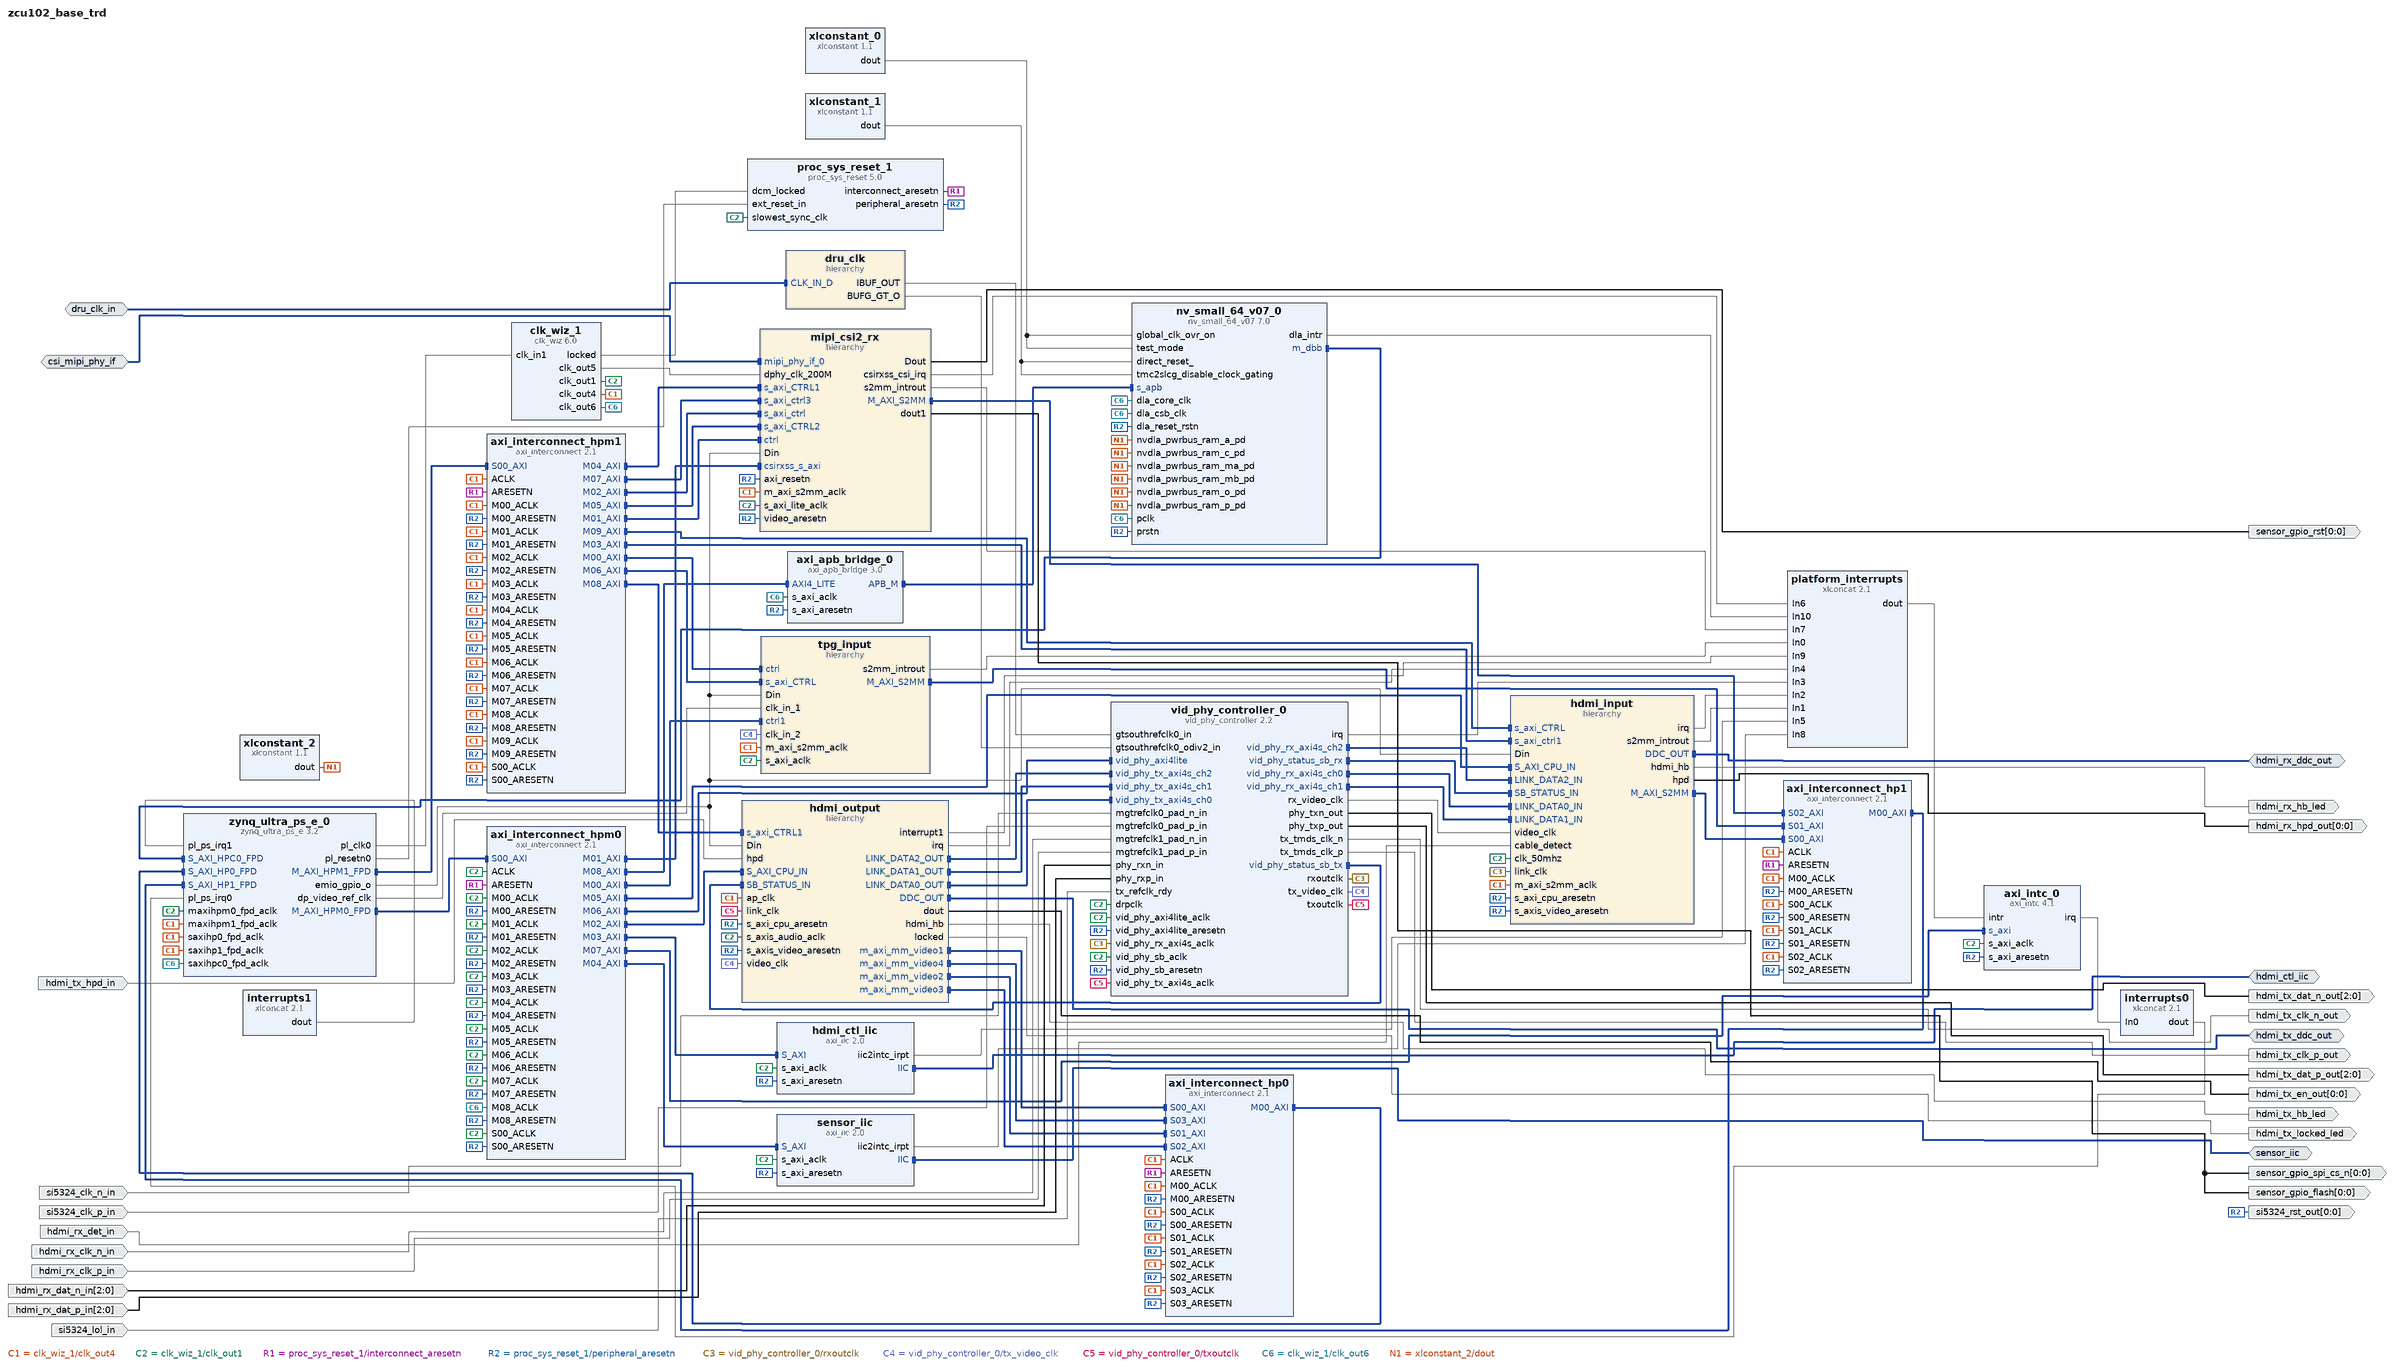
[diagram p0: block diagram of the top level]
# Vivado block design zcu102_base_trd, xczu9eg-ffvb1156-2-e, Vivado 2018.3
create_bd_design zcu102_base_trd

create_bd_intf_port -mode Slave -vlnv xilinx.com:interface:mipi_phy_rtl:1.0 csi_mipi_phy_if
create_bd_intf_port -mode Slave -vlnv xilinx.com:interface:diff_clock_rtl:1.0 dru_clk_in
create_bd_intf_port -mode Master -vlnv xilinx.com:interface:iic_rtl:1.0 hdmi_ctl_iic
create_bd_intf_port -mode Master -vlnv xilinx.com:interface:iic_rtl:1.0 hdmi_rx_ddc_out
create_bd_intf_port -mode Master -vlnv xilinx.com:interface:iic_rtl:1.0 hdmi_tx_ddc_out
create_bd_intf_port -mode Master -vlnv xilinx.com:interface:iic_rtl:1.0 sensor_iic
create_bd_port -dir I hdmi_rx_det_in
create_bd_port -dir O hdmi_rx_hb_led
create_bd_port -dir O -from 0 -to 0 hdmi_rx_hpd_out
create_bd_port -dir O -from 0 -to 0 hdmi_tx_en_out
create_bd_port -dir O hdmi_tx_hb_led
create_bd_port -dir O hdmi_tx_locked_led
create_bd_port -dir I hdmi_tx_hpd_in
create_bd_port -dir I si5324_clk_n_in
create_bd_port -dir I si5324_clk_p_in
create_bd_port -dir I hdmi_rx_clk_n_in
create_bd_port -dir I hdmi_rx_clk_p_in
create_bd_port -dir O -from 0 -to 0 sensor_gpio_rst
create_bd_port -dir I -from 2 -to 0 hdmi_rx_dat_n_in
create_bd_port -dir I -from 2 -to 0 hdmi_rx_dat_p_in
create_bd_port -dir O -from 0 -to 0 -type rst si5324_rst_out
create_bd_port -dir I si5324_lol_in
create_bd_port -dir O -from 0 -to 0 sensor_gpio_spi_cs_n
create_bd_port -dir O -from 0 -to 0 sensor_gpio_flash
create_bd_port -dir O -from 2 -to 0 hdmi_tx_dat_n_out
create_bd_port -dir O -from 2 -to 0 hdmi_tx_dat_p_out
create_bd_port -dir O hdmi_tx_clk_n_out
create_bd_port -dir O hdmi_tx_clk_p_out

create_bd_cell -type hier dru_clk
create_bd_cell -type hier hdmi_input
create_bd_cell -type hier hdmi_output
create_bd_cell -type ip -vlnv xilinx.com:ip:xlconcat:2.1 interrupts0
set_property -dict {CONFIG.NUM_PORTS 1} [get_bd_cells interrupts0]
create_bd_cell -type ip -vlnv xilinx.com:ip:xlconcat:2.1 interrupts1
set_property -dict {CONFIG.NUM_PORTS 1} [get_bd_cells interrupts1]
create_bd_cell -type hier mipi_csi2_rx
create_bd_cell -type ip -vlnv xilinx.com:ip:xlconcat:2.1 platform_interrupts
set_property -dict {CONFIG.NUM_PORTS 11} [get_bd_cells platform_interrupts]
create_bd_cell -type hier tpg_input
create_bd_cell -type ip -vlnv xilinx.com:ip:axi_apb_bridge:3.0 axi_apb_bridge_0
set_property -dict [list \
  CONFIG.C_APB_NUM_SLAVES 1 \
  CONFIG.C_S_AXI_RNG10_BASEADDR 0x0000000090000000 \
  CONFIG.C_S_AXI_RNG10_HIGHADDR 0x000000009FFFFFFF \
  CONFIG.C_S_AXI_RNG11_BASEADDR 0x00000000A0000000 \
  CONFIG.C_S_AXI_RNG11_HIGHADDR 0x00000000AFFFFFFF \
  CONFIG.C_S_AXI_RNG12_BASEADDR 0x00000000B0000000 \
  CONFIG.C_S_AXI_RNG12_HIGHADDR 0x00000000BFFFFFFF \
  CONFIG.C_S_AXI_RNG13_BASEADDR 0x00000000C0000000 \
  CONFIG.C_S_AXI_RNG13_HIGHADDR 0x00000000CFFFFFFF \
  CONFIG.C_S_AXI_RNG14_BASEADDR 0x00000000D0000000 \
  CONFIG.C_S_AXI_RNG14_HIGHADDR 0x00000000DFFFFFFF \
  CONFIG.C_S_AXI_RNG15_BASEADDR 0x00000000E0000000 \
  CONFIG.C_S_AXI_RNG15_HIGHADDR 0x00000000EFFFFFFF \
  CONFIG.C_S_AXI_RNG16_BASEADDR 0x00000000F0000000 \
  CONFIG.C_S_AXI_RNG16_HIGHADDR 0x00000000FFFFFFFF \
  CONFIG.C_S_AXI_RNG2_BASEADDR 0x0000000010000000 \
  CONFIG.C_S_AXI_RNG2_HIGHADDR 0x000000001FFFFFFF \
  CONFIG.C_S_AXI_RNG3_BASEADDR 0x0000000020000000 \
  CONFIG.C_S_AXI_RNG3_HIGHADDR 0x000000002FFFFFFF \
  CONFIG.C_S_AXI_RNG4_BASEADDR 0x0000000030000000 \
  CONFIG.C_S_AXI_RNG4_HIGHADDR 0x000000003FFFFFFF \
  CONFIG.C_S_AXI_RNG5_BASEADDR 0x0000000040000000 \
  CONFIG.C_S_AXI_RNG5_HIGHADDR 0x000000004FFFFFFF \
  CONFIG.C_S_AXI_RNG6_BASEADDR 0x0000000050000000 \
  CONFIG.C_S_AXI_RNG6_HIGHADDR 0x000000005FFFFFFF \
  CONFIG.C_S_AXI_RNG7_BASEADDR 0x0000000060000000 \
  CONFIG.C_S_AXI_RNG7_HIGHADDR 0x000000006FFFFFFF \
  CONFIG.C_S_AXI_RNG8_BASEADDR 0x0000000070000000 \
  CONFIG.C_S_AXI_RNG8_HIGHADDR 0x000000007FFFFFFF \
  CONFIG.C_S_AXI_RNG9_BASEADDR 0x0000000080000000 \
  CONFIG.C_S_AXI_RNG9_HIGHADDR 0x000000008FFFFFFF \
] [get_bd_cells axi_apb_bridge_0]
create_bd_cell -type ip -vlnv xilinx.com:ip:axi_intc:4.1 axi_intc_0
set_property -dict {CONFIG.C_IRQ_CONNECTION 1} [get_bd_cells axi_intc_0]
create_bd_cell -type ip -vlnv xilinx.com:ip:axi_interconnect:2.1 axi_interconnect_hp0
set_property -dict [list \
  CONFIG.ENABLE_ADVANCED_OPTIONS 0 \
  CONFIG.M00_HAS_DATA_FIFO 2 \
  CONFIG.M00_HAS_REGSLICE 1 \
  CONFIG.NUM_MI 1 \
  CONFIG.NUM_SI 4 \
  CONFIG.S00_HAS_DATA_FIFO 2 \
  CONFIG.S00_HAS_REGSLICE 1 \
  CONFIG.S01_HAS_DATA_FIFO 2 \
  CONFIG.S01_HAS_REGSLICE 1 \
  CONFIG.S02_HAS_DATA_FIFO 2 \
  CONFIG.S02_HAS_REGSLICE 1 \
  CONFIG.S03_HAS_DATA_FIFO 2 \
  CONFIG.S03_HAS_REGSLICE 1 \
  CONFIG.S04_HAS_DATA_FIFO 2 \
  CONFIG.S04_HAS_REGSLICE 1 \
  CONFIG.S05_HAS_DATA_FIFO 2 \
  CONFIG.S05_HAS_REGSLICE 1 \
  CONFIG.S06_HAS_DATA_FIFO 2 \
  CONFIG.S06_HAS_REGSLICE 1 \
  CONFIG.STRATEGY 2 \
  CONFIG.SYNCHRONIZATION_STAGES 2 \
] [get_bd_cells axi_interconnect_hp0]
create_bd_cell -type ip -vlnv xilinx.com:ip:axi_interconnect:2.1 axi_interconnect_hp1
set_property -dict [list \
  CONFIG.ENABLE_ADVANCED_OPTIONS 0 \
  CONFIG.M00_HAS_DATA_FIFO 2 \
  CONFIG.M00_HAS_REGSLICE 1 \
  CONFIG.NUM_MI 1 \
  CONFIG.NUM_SI 3 \
  CONFIG.S00_HAS_DATA_FIFO 2 \
  CONFIG.S00_HAS_REGSLICE 1 \
  CONFIG.S01_HAS_DATA_FIFO 2 \
  CONFIG.S01_HAS_REGSLICE 1 \
  CONFIG.S02_HAS_DATA_FIFO 2 \
  CONFIG.S02_HAS_REGSLICE 1 \
  CONFIG.S03_HAS_DATA_FIFO 2 \
  CONFIG.S03_HAS_REGSLICE 1 \
  CONFIG.S04_HAS_DATA_FIFO 2 \
  CONFIG.S04_HAS_REGSLICE 1 \
  CONFIG.S05_HAS_DATA_FIFO 2 \
  CONFIG.S05_HAS_REGSLICE 1 \
  CONFIG.S06_HAS_DATA_FIFO 2 \
  CONFIG.S06_HAS_REGSLICE 1 \
  CONFIG.STRATEGY 2 \
  CONFIG.SYNCHRONIZATION_STAGES 2 \
] [get_bd_cells axi_interconnect_hp1]
create_bd_cell -type ip -vlnv xilinx.com:ip:axi_interconnect:2.1 axi_interconnect_hpm0
set_property -dict {CONFIG.NUM_MI 9 CONFIG.STRATEGY 1 CONFIG.SYNCHRONIZATION_STAGES 2} [get_bd_cells axi_interconnect_hpm0]
create_bd_cell -type ip -vlnv xilinx.com:ip:axi_interconnect:2.1 axi_interconnect_hpm1
set_property -dict [list \
  CONFIG.ENABLE_ADVANCED_OPTIONS 0 \
  CONFIG.M00_HAS_REGSLICE 1 \
  CONFIG.M01_HAS_REGSLICE 1 \
  CONFIG.M02_HAS_REGSLICE 1 \
  CONFIG.M03_HAS_REGSLICE 1 \
  CONFIG.M04_HAS_REGSLICE 1 \
  CONFIG.M05_HAS_REGSLICE 1 \
  CONFIG.M06_HAS_REGSLICE 1 \
  CONFIG.M07_HAS_REGSLICE 1 \
  CONFIG.M08_HAS_REGSLICE 1 \
  CONFIG.M09_HAS_REGSLICE 1 \
  CONFIG.M10_HAS_REGSLICE 1 \
  CONFIG.NUM_MI 10 \
  CONFIG.S00_HAS_REGSLICE 1 \
  CONFIG.STRATEGY 1 \
  CONFIG.SYNCHRONIZATION_STAGES 2 \
] [get_bd_cells axi_interconnect_hpm1]
create_bd_cell -type ip -vlnv xilinx.com:ip:clk_wiz:6.0 clk_wiz_1
set_property -dict [list \
  CONFIG.CLKIN1_JITTER_PS 200.02 \
  CONFIG.CLKOUT1_DRIVES Buffer \
  CONFIG.CLKOUT1_JITTER 163.726 \
  CONFIG.CLKOUT1_PHASE_ERROR 154.695 \
  CONFIG.CLKOUT1_REQUESTED_OUT_FREQ 50.000 \
  CONFIG.CLKOUT2_DRIVES Buffer \
  CONFIG.CLKOUT2_JITTER 148.390 \
  CONFIG.CLKOUT2_PHASE_ERROR 154.695 \
  CONFIG.CLKOUT2_REQUESTED_OUT_FREQ 75.000 \
  CONFIG.CLKOUT2_USED true \
  CONFIG.CLKOUT3_DRIVES Buffer \
  CONFIG.CLKOUT3_JITTER 129.940 \
  CONFIG.CLKOUT3_PHASE_ERROR 154.695 \
  CONFIG.CLKOUT3_REQUESTED_OUT_FREQ 150.000 \
  CONFIG.CLKOUT3_USED true \
  CONFIG.CLKOUT4_DRIVES Buffer \
  CONFIG.CLKOUT4_JITTER 116.512 \
  CONFIG.CLKOUT4_PHASE_ERROR 154.695 \
  CONFIG.CLKOUT4_REQUESTED_OUT_FREQ 300.000 \
  CONFIG.CLKOUT4_USED true \
  CONFIG.CLKOUT5_DRIVES Buffer \
  CONFIG.CLKOUT5_JITTER 124.151 \
  CONFIG.CLKOUT5_PHASE_ERROR 154.695 \
  CONFIG.CLKOUT5_REQUESTED_OUT_FREQ 200.000 \
  CONFIG.CLKOUT5_USED true \
  CONFIG.CLKOUT6_DRIVES Buffer \
  CONFIG.CLKOUT6_JITTER 129.940 \
  CONFIG.CLKOUT6_PHASE_ERROR 154.695 \
  CONFIG.CLKOUT6_REQUESTED_OUT_FREQ 150.000 \
  CONFIG.CLKOUT6_USED true \
  CONFIG.CLKOUT7_DRIVES Buffer \
  CONFIG.MMCM_CLKFBOUT_MULT_F 24.000 \
  CONFIG.MMCM_CLKIN1_PERIOD 20.002 \
  CONFIG.MMCM_CLKIN2_PERIOD 10.0 \
  CONFIG.MMCM_CLKOUT0_DIVIDE_F 24.000 \
  CONFIG.MMCM_CLKOUT1_DIVIDE 16 \
  CONFIG.MMCM_CLKOUT2_DIVIDE 8 \
  CONFIG.MMCM_CLKOUT3_DIVIDE 4 \
  CONFIG.MMCM_CLKOUT4_DIVIDE 6 \
  CONFIG.MMCM_CLKOUT5_DIVIDE 8 \
  CONFIG.MMCM_DIVCLK_DIVIDE 1 \
  CONFIG.NUM_OUT_CLKS 6 \
  CONFIG.PHASESHIFT_MODE LATENCY \
  CONFIG.PRIM_SOURCE No_buffer \
  CONFIG.USE_INCLK_SWITCHOVER false \
  CONFIG.USE_PHASE_ALIGNMENT true \
  CONFIG.USE_RESET false \
] [get_bd_cells clk_wiz_1]
create_bd_cell -type ip -vlnv xilinx.com:ip:axi_iic:2.0 hdmi_ctl_iic
create_bd_cell -type ip -vlnv xilinx.com:ip:proc_sys_reset:5.0 proc_sys_reset_1
set_property -dict {CONFIG.C_AUX_RESET_HIGH 0} [get_bd_cells proc_sys_reset_1]
create_bd_cell -type ip -vlnv xilinx.com:ip:axi_iic:2.0 sensor_iic
set_property -dict {CONFIG.IIC_FREQ_KHZ 400} [get_bd_cells sensor_iic]
create_bd_cell -type ip -vlnv xilinx.com:ip:vid_phy_controller:2.2 vid_phy_controller_0
set_property -dict [list \
  CONFIG.CHANNEL_ENABLE {X0Y4 X0Y5 X0Y6} \
  CONFIG.CHANNEL_SITE X0Y4 \
  CONFIG.C_FOR_UPGRADE_ARCHITECTURE placeholder \
  CONFIG.C_FOR_UPGRADE_DEVICE placeholder \
  CONFIG.C_FOR_UPGRADE_MAXOPTVOL 0.00 \
  CONFIG.C_FOR_UPGRADE_PACKAGE placeholder \
  CONFIG.C_FOR_UPGRADE_PART placeholder \
  CONFIG.C_FOR_UPGRADE_REFVOL 0.00 \
  CONFIG.C_FOR_UPGRADE_SPEEDGRADE 0 \
  CONFIG.C_INPUT_PIXELS_PER_CLOCK 2 \
  CONFIG.C_INT_HDMI_VER_CMPTBLE 3 \
  CONFIG.C_NIDRU true \
  CONFIG.C_NIDRU_REFCLK_SEL 4 \
  CONFIG.C_RX_REFCLK_SEL 1 \
  CONFIG.C_Rx_Protocol HDMI \
  CONFIG.C_TX_PLL_SELECTION 6 \
  CONFIG.C_TX_REFCLK_SEL 0 \
  CONFIG.C_Tx_Protocol HDMI \
  CONFIG.C_Txrefclk_Rdy_Invert true \
  CONFIG.C_Use_Oddr_for_Tmds_Clkout true \
  CONFIG.C_vid_phy_rx_axi4s_ch_INT_TDATA_WIDTH 20 \
  CONFIG.C_vid_phy_rx_axi4s_ch_TDATA_WIDTH 20 \
  CONFIG.C_vid_phy_rx_axi4s_ch_TUSER_WIDTH 1 \
  CONFIG.C_vid_phy_tx_axi4s_ch_INT_TDATA_WIDTH 20 \
  CONFIG.C_vid_phy_tx_axi4s_ch_TDATA_WIDTH 20 \
  CONFIG.C_vid_phy_tx_axi4s_ch_TUSER_WIDTH 1 \
  CONFIG.Rx_GT_Line_Rate 5.94 \
  CONFIG.Rx_GT_Ref_Clock_Freq 297 \
  CONFIG.Tx_GT_Line_Rate 5.94 \
  CONFIG.Tx_GT_Ref_Clock_Freq 297 \
] [get_bd_cells vid_phy_controller_0]
create_bd_cell -type ip -vlnv xilinx.com:ip:xlconstant:1.1 xlconstant_0
set_property -dict {CONFIG.CONST_VAL 0} [get_bd_cells xlconstant_0]
create_bd_cell -type ip -vlnv xilinx.com:ip:xlconstant:1.1 xlconstant_1
create_bd_cell -type ip -vlnv xilinx.com:ip:xlconstant:1.1 xlconstant_2
set_property -dict {CONFIG.CONST_VAL 0 CONFIG.CONST_WIDTH 32} [get_bd_cells xlconstant_2]
create_bd_cell -type ip -vlnv xilinx.com:ip:zynq_ultra_ps_e:3.2 zynq_ultra_ps_e_0
set_property -dict [list \
  CONFIG.CAN0_BOARD_INTERFACE custom \
  CONFIG.CAN1_BOARD_INTERFACE custom \
  CONFIG.CSU_BOARD_INTERFACE custom \
  CONFIG.DP_BOARD_INTERFACE custom \
  CONFIG.GEM0_BOARD_INTERFACE custom \
  CONFIG.GEM1_BOARD_INTERFACE custom \
  CONFIG.GEM2_BOARD_INTERFACE custom \
  CONFIG.GEM3_BOARD_INTERFACE custom \
  CONFIG.GPIO_BOARD_INTERFACE custom \
  CONFIG.IIC0_BOARD_INTERFACE custom \
  CONFIG.IIC1_BOARD_INTERFACE custom \
  CONFIG.NAND_BOARD_INTERFACE custom \
  CONFIG.PCIE_BOARD_INTERFACE custom \
  CONFIG.PJTAG_BOARD_INTERFACE custom \
  CONFIG.PMU_BOARD_INTERFACE custom \
  CONFIG.PSU_BANK_0_IO_STANDARD LVCMOS18 \
  CONFIG.PSU_BANK_1_IO_STANDARD LVCMOS18 \
  CONFIG.PSU_BANK_2_IO_STANDARD LVCMOS18 \
  CONFIG.PSU_BANK_3_IO_STANDARD LVCMOS33 \
  CONFIG.PSU__CAN1__PERIPHERAL__ENABLE 1 \
  CONFIG.PSU__CAN1__PERIPHERAL__IO {MIO 24 .. 25} \
  CONFIG.PSU__CRF_APB__ACPU_CTRL__FREQMHZ 1200 \
  CONFIG.PSU__CRF_APB__ACPU_CTRL__SRCSEL APLL \
  CONFIG.PSU__CRF_APB__APLL_CTRL__SRCSEL PSS_REF_CLK \
  CONFIG.PSU__CRF_APB__DBG_FPD_CTRL__FREQMHZ 250 \
  CONFIG.PSU__CRF_APB__DBG_FPD_CTRL__SRCSEL IOPLL \
  CONFIG.PSU__CRF_APB__DBG_TRACE_CTRL__FREQMHZ 250 \
  CONFIG.PSU__CRF_APB__DBG_TRACE_CTRL__SRCSEL IOPLL \
  CONFIG.PSU__CRF_APB__DBG_TSTMP_CTRL__FREQMHZ 250 \
  CONFIG.PSU__CRF_APB__DBG_TSTMP_CTRL__SRCSEL IOPLL \
  CONFIG.PSU__CRF_APB__DDR_CTRL__FREQMHZ 1067 \
  CONFIG.PSU__CRF_APB__DDR_CTRL__SRCSEL DPLL \
  CONFIG.PSU__CRF_APB__DPDMA_REF_CTRL__FREQMHZ 600 \
  CONFIG.PSU__CRF_APB__DPDMA_REF_CTRL__SRCSEL APLL \
  CONFIG.PSU__CRF_APB__DPLL_CTRL__SRCSEL PSS_REF_CLK \
  CONFIG.PSU__CRF_APB__DP_AUDIO_REF_CTRL__SRCSEL RPLL \
  CONFIG.PSU__CRF_APB__DP_STC_REF_CTRL__SRCSEL RPLL \
  CONFIG.PSU__CRF_APB__DP_VIDEO_REF_CTRL__SRCSEL VPLL \
  CONFIG.PSU__CRF_APB__GDMA_REF_CTRL__FREQMHZ 600 \
  CONFIG.PSU__CRF_APB__GDMA_REF_CTRL__SRCSEL APLL \
  CONFIG.PSU__CRF_APB__GPU_REF_CTRL__FREQMHZ 500 \
  CONFIG.PSU__CRF_APB__GPU_REF_CTRL__SRCSEL IOPLL \
  CONFIG.PSU__CRF_APB__TOPSW_LSBUS_CTRL__FREQMHZ 100 \
  CONFIG.PSU__CRF_APB__TOPSW_LSBUS_CTRL__SRCSEL IOPLL \
  CONFIG.PSU__CRF_APB__TOPSW_MAIN_CTRL__FREQMHZ 533.33 \
  CONFIG.PSU__CRF_APB__TOPSW_MAIN_CTRL__SRCSEL DPLL \
  CONFIG.PSU__CRF_APB__VPLL_CTRL__SRCSEL PSS_REF_CLK \
  CONFIG.PSU__CRL_APB__ADMA_REF_CTRL__FREQMHZ 500 \
  CONFIG.PSU__CRL_APB__ADMA_REF_CTRL__SRCSEL IOPLL \
  CONFIG.PSU__CRL_APB__CAN1_REF_CTRL__FREQMHZ 100 \
  CONFIG.PSU__CRL_APB__CAN1_REF_CTRL__SRCSEL IOPLL \
  CONFIG.PSU__CRL_APB__CPU_R5_CTRL__FREQMHZ 500 \
  CONFIG.PSU__CRL_APB__CPU_R5_CTRL__SRCSEL IOPLL \
  CONFIG.PSU__CRL_APB__DBG_LPD_CTRL__FREQMHZ 250 \
  CONFIG.PSU__CRL_APB__DBG_LPD_CTRL__SRCSEL IOPLL \
  CONFIG.PSU__CRL_APB__GEM3_REF_CTRL__FREQMHZ 125 \
  CONFIG.PSU__CRL_APB__GEM3_REF_CTRL__SRCSEL IOPLL \
  CONFIG.PSU__CRL_APB__I2C0_REF_CTRL__FREQMHZ 100 \
  CONFIG.PSU__CRL_APB__I2C0_REF_CTRL__SRCSEL IOPLL \
  CONFIG.PSU__CRL_APB__I2C1_REF_CTRL__FREQMHZ 100 \
  CONFIG.PSU__CRL_APB__I2C1_REF_CTRL__SRCSEL IOPLL \
  CONFIG.PSU__CRL_APB__IOPLL_CTRL__SRCSEL PSS_REF_CLK \
  CONFIG.PSU__CRL_APB__IOU_SWITCH_CTRL__FREQMHZ 250 \
  CONFIG.PSU__CRL_APB__IOU_SWITCH_CTRL__SRCSEL IOPLL \
  CONFIG.PSU__CRL_APB__LPD_LSBUS_CTRL__FREQMHZ 100 \
  CONFIG.PSU__CRL_APB__LPD_LSBUS_CTRL__SRCSEL IOPLL \
  CONFIG.PSU__CRL_APB__LPD_SWITCH_CTRL__FREQMHZ 500 \
  CONFIG.PSU__CRL_APB__LPD_SWITCH_CTRL__SRCSEL IOPLL \
  CONFIG.PSU__CRL_APB__PCAP_CTRL__FREQMHZ 200 \
  CONFIG.PSU__CRL_APB__PCAP_CTRL__SRCSEL IOPLL \
  CONFIG.PSU__CRL_APB__PL0_REF_CTRL__FREQMHZ 50 \
  CONFIG.PSU__CRL_APB__PL0_REF_CTRL__SRCSEL IOPLL \
  CONFIG.PSU__CRL_APB__QSPI_REF_CTRL__FREQMHZ 125 \
  CONFIG.PSU__CRL_APB__QSPI_REF_CTRL__SRCSEL IOPLL \
  CONFIG.PSU__CRL_APB__RPLL_CTRL__SRCSEL PSS_REF_CLK \
  CONFIG.PSU__CRL_APB__SDIO1_REF_CTRL__FREQMHZ 200 \
  CONFIG.PSU__CRL_APB__SDIO1_REF_CTRL__SRCSEL IOPLL \
  CONFIG.PSU__CRL_APB__TIMESTAMP_REF_CTRL__FREQMHZ 100 \
  CONFIG.PSU__CRL_APB__TIMESTAMP_REF_CTRL__SRCSEL IOPLL \
  CONFIG.PSU__CRL_APB__UART0_REF_CTRL__FREQMHZ 100 \
  CONFIG.PSU__CRL_APB__UART0_REF_CTRL__SRCSEL IOPLL \
  CONFIG.PSU__CRL_APB__UART1_REF_CTRL__FREQMHZ 100 \
  CONFIG.PSU__CRL_APB__UART1_REF_CTRL__SRCSEL IOPLL \
  CONFIG.PSU__CRL_APB__USB0_BUS_REF_CTRL__FREQMHZ 250 \
  CONFIG.PSU__CRL_APB__USB0_BUS_REF_CTRL__SRCSEL IOPLL \
  CONFIG.PSU__CRL_APB__USB3_DUAL_REF_CTRL__FREQMHZ 20 \
  CONFIG.PSU__CRL_APB__USB3_DUAL_REF_CTRL__SRCSEL IOPLL \
  CONFIG.PSU__CRL_APB__USB3__ENABLE 1 \
  CONFIG.PSU__CSUPMU__PERIPHERAL__VALID 1 \
  CONFIG.PSU__DDRC__BUS_WIDTH {64 Bit} \
  CONFIG.PSU__DDRC__COMPONENTS UDIMM \
  CONFIG.PSU__DDRC__DEVICE_CAPACITY {4096 MBits} \
  CONFIG.PSU__DDRC__DRAM_WIDTH {8 Bits} \
  CONFIG.PSU__DDRC__ECC Disabled \
  CONFIG.PSU__DDRC__MEMORY_TYPE {DDR 4} \
  CONFIG.PSU__DDRC__SPEED_BIN DDR4_2133P \
  CONFIG.PSU__DDR_HIGH_ADDRESS_GUI_ENABLE 1 \
  CONFIG.PSU__DDR__INTERFACE__FREQMHZ 533.500 \
  CONFIG.PSU__DEVICE_TYPE EG \
  CONFIG.PSU__DISPLAYPORT__LANE0__ENABLE 1 \
  CONFIG.PSU__DISPLAYPORT__LANE0__IO {GT Lane1} \
  CONFIG.PSU__DISPLAYPORT__LANE1__ENABLE 1 \
  CONFIG.PSU__DISPLAYPORT__LANE1__IO {GT Lane0} \
  CONFIG.PSU__DISPLAYPORT__PERIPHERAL__ENABLE 1 \
  CONFIG.PSU__DLL__ISUSED 1 \
  CONFIG.PSU__DPAUX__PERIPHERAL__ENABLE 1 \
  CONFIG.PSU__DPAUX__PERIPHERAL__IO {MIO 27 .. 30} \
  CONFIG.PSU__DP__LANE_SEL {Dual Lower} \
  CONFIG.PSU__DP__REF_CLK_FREQ 27 \
  CONFIG.PSU__DP__REF_CLK_SEL {Ref Clk3} \
  CONFIG.PSU__ENET3__FIFO__ENABLE 0 \
  CONFIG.PSU__ENET3__GRP_MDIO__ENABLE 1 \
  CONFIG.PSU__ENET3__GRP_MDIO__IO {MIO 76 .. 77} \
  CONFIG.PSU__ENET3__PERIPHERAL__ENABLE 1 \
  CONFIG.PSU__ENET3__PERIPHERAL__IO {MIO 64 .. 75} \
  CONFIG.PSU__ENET3__PTP__ENABLE 0 \
  CONFIG.PSU__ENET3__TSU__ENABLE 0 \
  CONFIG.PSU__FPGA_PL0_ENABLE 1 \
  CONFIG.PSU__GEM3_COHERENCY 0 \
  CONFIG.PSU__GEM__TSU__ENABLE 0 \
  CONFIG.PSU__GPIO0_MIO__IO {MIO 0 .. 25} \
  CONFIG.PSU__GPIO0_MIO__PERIPHERAL__ENABLE 1 \
  CONFIG.PSU__GPIO1_MIO__IO {MIO 26 .. 51} \
  CONFIG.PSU__GPIO1_MIO__PERIPHERAL__ENABLE 1 \
  CONFIG.PSU__GPIO_EMIO_WIDTH 95 \
  CONFIG.PSU__GPIO_EMIO__PERIPHERAL__ENABLE 1 \
  CONFIG.PSU__GPIO_EMIO__PERIPHERAL__IO 95 \
  CONFIG.PSU__GT__LINK_SPEED HBR \
  CONFIG.PSU__GT__PRE_EMPH_LVL_4 0 \
  CONFIG.PSU__GT__VLT_SWNG_LVL_4 0 \
  CONFIG.PSU__I2C0__PERIPHERAL__ENABLE 1 \
  CONFIG.PSU__I2C0__PERIPHERAL__IO {MIO 14 .. 15} \
  CONFIG.PSU__I2C1__PERIPHERAL__ENABLE 1 \
  CONFIG.PSU__I2C1__PERIPHERAL__IO {MIO 16 .. 17} \
  CONFIG.PSU__IOU_SLCR__IOU_TTC_APB_CLK__TTC0_SEL APB \
  CONFIG.PSU__IOU_SLCR__IOU_TTC_APB_CLK__TTC1_SEL APB \
  CONFIG.PSU__IOU_SLCR__IOU_TTC_APB_CLK__TTC2_SEL APB \
  CONFIG.PSU__IOU_SLCR__IOU_TTC_APB_CLK__TTC3_SEL APB \
  CONFIG.PSU__MAXIGP0__DATA_WIDTH 32 \
  CONFIG.PSU__MAXIGP1__DATA_WIDTH 32 \
  CONFIG.PSU__OVERRIDE__BASIC_CLOCK 0 \
  CONFIG.PSU__PCIE__CLASS_CODE_BASE 0x06 \
  CONFIG.PSU__PCIE__CLASS_CODE_SUB 0x4 \
  CONFIG.PSU__PCIE__DEVICE_ID 0xD021 \
  CONFIG.PSU__PMU_COHERENCY 0 \
  CONFIG.PSU__PMU__AIBACK__ENABLE 0 \
  CONFIG.PSU__PMU__EMIO_GPI__ENABLE 0 \
  CONFIG.PSU__PMU__EMIO_GPO__ENABLE 0 \
  CONFIG.PSU__PMU__GPI0__ENABLE 0 \
  CONFIG.PSU__PMU__GPI1__ENABLE 0 \
  CONFIG.PSU__PMU__GPI2__ENABLE 0 \
  CONFIG.PSU__PMU__GPI3__ENABLE 0 \
  CONFIG.PSU__PMU__GPI4__ENABLE 0 \
  CONFIG.PSU__PMU__GPI5__ENABLE 0 \
  CONFIG.PSU__PMU__GPO0__ENABLE 1 \
  CONFIG.PSU__PMU__GPO0__IO {MIO 32} \
  CONFIG.PSU__PMU__GPO1__ENABLE 1 \
  CONFIG.PSU__PMU__GPO1__IO {MIO 33} \
  CONFIG.PSU__PMU__GPO2__ENABLE 1 \
  CONFIG.PSU__PMU__GPO2__IO {MIO 34} \
  CONFIG.PSU__PMU__GPO2__POLARITY low \
  CONFIG.PSU__PMU__GPO3__ENABLE 1 \
  CONFIG.PSU__PMU__GPO3__IO {MIO 35} \
  CONFIG.PSU__PMU__GPO3__POLARITY low \
  CONFIG.PSU__PMU__GPO4__ENABLE 1 \
  CONFIG.PSU__PMU__GPO4__IO {MIO 36} \
  CONFIG.PSU__PMU__GPO4__POLARITY low \
  CONFIG.PSU__PMU__GPO5__ENABLE 1 \
  CONFIG.PSU__PMU__GPO5__IO {MIO 37} \
  CONFIG.PSU__PMU__GPO5__POLARITY low \
  CONFIG.PSU__PMU__PERIPHERAL__ENABLE 1 \
  CONFIG.PSU__PMU__PLERROR__ENABLE 0 \
  CONFIG.PSU__PRESET_APPLIED 1 \
  CONFIG.PSU__PSS_REF_CLK__FREQMHZ 33.330 \
  CONFIG.PSU__QSPI_COHERENCY 0 \
  CONFIG.PSU__QSPI__GRP_FBCLK__ENABLE 1 \
  CONFIG.PSU__QSPI__GRP_FBCLK__IO {MIO 6} \
  CONFIG.PSU__QSPI__PERIPHERAL__DATA_MODE x4 \
  CONFIG.PSU__QSPI__PERIPHERAL__ENABLE 1 \
  CONFIG.PSU__QSPI__PERIPHERAL__IO {MIO 0 .. 12} \
  CONFIG.PSU__QSPI__PERIPHERAL__MODE {Dual Parallel} \
  CONFIG.PSU__SATA__LANE1__IO {GT Lane3} \
  CONFIG.PSU__SATA__PERIPHERAL__ENABLE 1 \
  CONFIG.PSU__SATA__REF_CLK_FREQ 125 \
  CONFIG.PSU__SATA__REF_CLK_SEL {Ref Clk1} \
  CONFIG.PSU__SAXIGP0__DATA_WIDTH 64 \
  CONFIG.PSU__SD1_COHERENCY 0 \
  CONFIG.PSU__SD1__DATA_TRANSFER_MODE 8Bit \
  CONFIG.PSU__SD1__GRP_CD__ENABLE 1 \
  CONFIG.PSU__SD1__GRP_CD__IO {MIO 45} \
  CONFIG.PSU__SD1__GRP_POW__ENABLE 0 \
  CONFIG.PSU__SD1__GRP_WP__ENABLE 1 \
  CONFIG.PSU__SD1__GRP_WP__IO {MIO 44} \
  CONFIG.PSU__SD1__PERIPHERAL__ENABLE 1 \
  CONFIG.PSU__SD1__PERIPHERAL__IO {MIO 39 .. 51} \
  CONFIG.PSU__SD1__SLOT_TYPE {SD 3.0} \
  CONFIG.PSU__SWDT0__CLOCK__ENABLE 0 \
  CONFIG.PSU__SWDT0__PERIPHERAL__ENABLE 1 \
  CONFIG.PSU__SWDT0__RESET__ENABLE 0 \
  CONFIG.PSU__SWDT1__CLOCK__ENABLE 0 \
  CONFIG.PSU__SWDT1__PERIPHERAL__ENABLE 1 \
  CONFIG.PSU__SWDT1__RESET__ENABLE 0 \
  CONFIG.PSU__TSU__BUFG_PORT_PAIR 0 \
  CONFIG.PSU__TTC0__CLOCK__ENABLE 0 \
  CONFIG.PSU__TTC0__PERIPHERAL__ENABLE 1 \
  CONFIG.PSU__TTC0__WAVEOUT__ENABLE 0 \
  CONFIG.PSU__TTC1__CLOCK__ENABLE 0 \
  CONFIG.PSU__TTC1__PERIPHERAL__ENABLE 1 \
  CONFIG.PSU__TTC1__WAVEOUT__ENABLE 0 \
  CONFIG.PSU__TTC2__CLOCK__ENABLE 0 \
  CONFIG.PSU__TTC2__PERIPHERAL__ENABLE 1 \
  CONFIG.PSU__TTC2__WAVEOUT__ENABLE 0 \
  CONFIG.PSU__TTC3__CLOCK__ENABLE 0 \
  CONFIG.PSU__TTC3__PERIPHERAL__ENABLE 1 \
  CONFIG.PSU__TTC3__WAVEOUT__ENABLE 0 \
  CONFIG.PSU__UART0__BAUD_RATE 115200 \
  CONFIG.PSU__UART0__MODEM__ENABLE 0 \
  CONFIG.PSU__UART0__PERIPHERAL__ENABLE 1 \
  CONFIG.PSU__UART0__PERIPHERAL__IO {MIO 18 .. 19} \
  CONFIG.PSU__UART1__BAUD_RATE 115200 \
  CONFIG.PSU__UART1__MODEM__ENABLE 0 \
  CONFIG.PSU__UART1__PERIPHERAL__ENABLE 1 \
  CONFIG.PSU__UART1__PERIPHERAL__IO {MIO 20 .. 21} \
  CONFIG.PSU__USB0_COHERENCY 0 \
  CONFIG.PSU__USB0__PERIPHERAL__ENABLE 1 \
  CONFIG.PSU__USB0__PERIPHERAL__IO {MIO 52 .. 63} \
  CONFIG.PSU__USB0__REF_CLK_FREQ 26 \
  CONFIG.PSU__USB0__REF_CLK_SEL {Ref Clk2} \
  CONFIG.PSU__USB2_0__EMIO__ENABLE 0 \
  CONFIG.PSU__USB3_0__EMIO__ENABLE 0 \
  CONFIG.PSU__USB3_0__PERIPHERAL__ENABLE 1 \
  CONFIG.PSU__USB3_0__PERIPHERAL__IO {GT Lane2} \
  CONFIG.PSU__USB__RESET__MODE {Boot Pin} \
  CONFIG.PSU__USB__RESET__POLARITY {Active Low} \
  CONFIG.PSU__USE__IRQ0 1 \
  CONFIG.PSU__USE__IRQ1 1 \
  CONFIG.PSU__USE__M_AXI_GP0 1 \
  CONFIG.PSU__USE__M_AXI_GP1 1 \
  CONFIG.PSU__USE__M_AXI_GP2 0 \
  CONFIG.PSU__USE__S_AXI_GP0 1 \
  CONFIG.PSU__USE__S_AXI_GP2 1 \
  CONFIG.PSU__USE__S_AXI_GP3 1 \
  CONFIG.PSU__USE__VIDEO 1 \
  CONFIG.QSPI_BOARD_INTERFACE custom \
  CONFIG.SATA_BOARD_INTERFACE custom \
  CONFIG.SD0_BOARD_INTERFACE custom \
  CONFIG.SD1_BOARD_INTERFACE custom \
  CONFIG.SPI0_BOARD_INTERFACE custom \
  CONFIG.SPI1_BOARD_INTERFACE custom \
  CONFIG.SUBPRESET2 Custom \
  CONFIG.SWDT0_BOARD_INTERFACE custom \
  CONFIG.SWDT1_BOARD_INTERFACE custom \
  CONFIG.TRACE_BOARD_INTERFACE custom \
  CONFIG.TTC0_BOARD_INTERFACE custom \
  CONFIG.TTC1_BOARD_INTERFACE custom \
  CONFIG.TTC2_BOARD_INTERFACE custom \
  CONFIG.TTC3_BOARD_INTERFACE custom \
  CONFIG.UART0_BOARD_INTERFACE custom \
  CONFIG.UART1_BOARD_INTERFACE custom \
  CONFIG.USB0_BOARD_INTERFACE custom \
  CONFIG.USB1_BOARD_INTERFACE custom \
] [get_bd_cells zynq_ultra_ps_e_0]
# 715 more settings of zynq_ultra_ps_e_0 are not shown: defaults, MIO pin electricals, DDR timing, and values the tool derives
create_bd_cell -type ip -vlnv xilinx.com:user:nv_small_64_v07:7.0 nv_small_64_v07_0

# ---- hierarchy /dru_clk ----
current_bd_instance /dru_clk
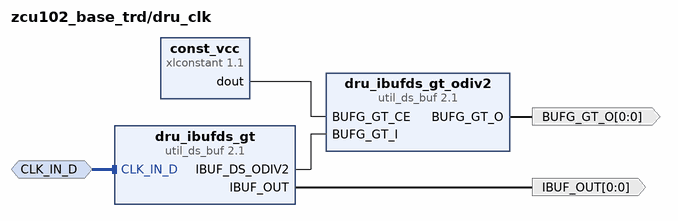
[diagram p1: block diagram inside /dru_clk]
create_bd_intf_pin -mode Slave -vlnv xilinx.com:interface:diff_clock_rtl:1.0 CLK_IN_D
create_bd_pin -dir O -from 0 -to 0 BUFG_GT_O
create_bd_pin -dir O -from 0 -to 0 IBUF_OUT

create_bd_cell -type ip -vlnv xilinx.com:ip:xlconstant:1.1 const_vcc
create_bd_cell -type ip -vlnv xilinx.com:ip:util_ds_buf:2.1 dru_ibufds_gt
set_property -dict {CONFIG.C_BUF_TYPE IBUFDSGTE} [get_bd_cells dru_ibufds_gt]
create_bd_cell -type ip -vlnv xilinx.com:ip:util_ds_buf:2.1 dru_ibufds_gt_odiv2
set_property -dict {CONFIG.C_BUF_TYPE BUFG_GT} [get_bd_cells dru_ibufds_gt_odiv2]

# ---- hierarchy /hdmi_input ----
current_bd_instance /hdmi_input
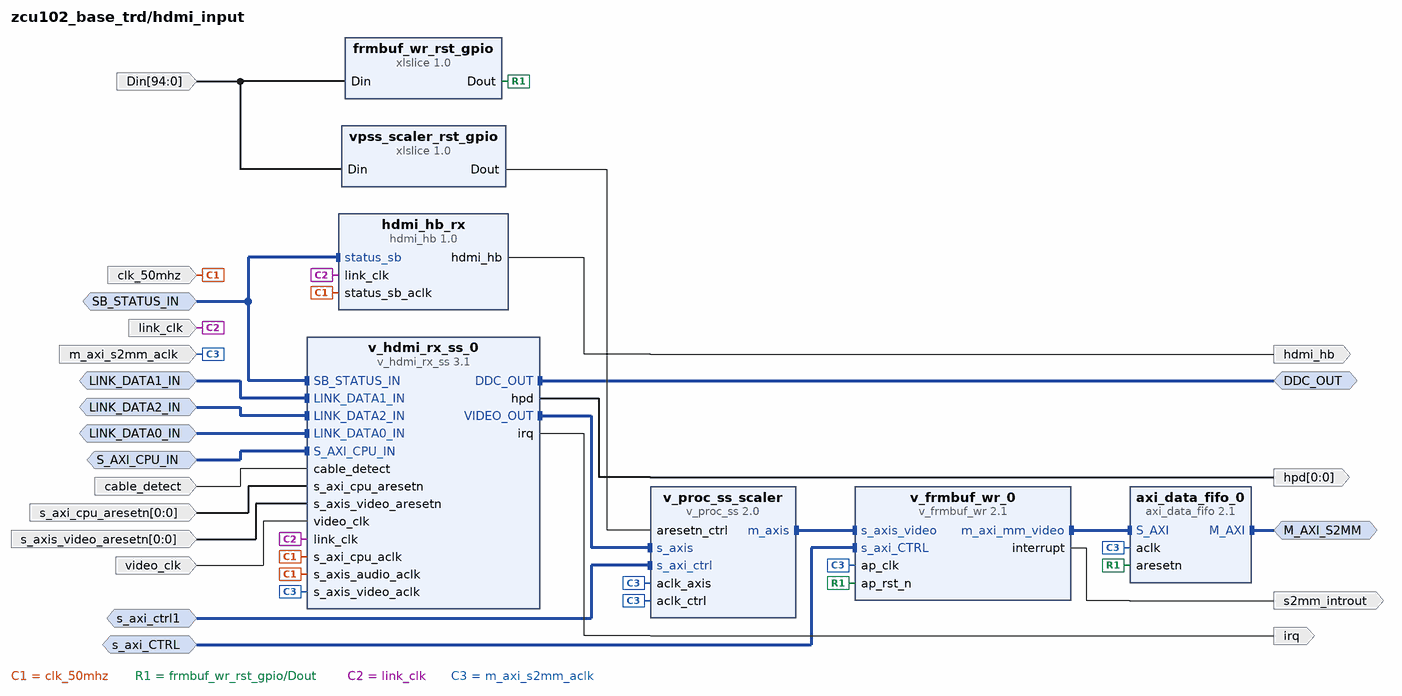
[diagram p2: block diagram inside /hdmi_input]
create_bd_intf_pin -mode Master -vlnv xilinx.com:interface:iic_rtl:1.0 DDC_OUT
create_bd_intf_pin -mode Slave -vlnv xilinx.com:interface:axis_rtl:1.0 LINK_DATA0_IN
create_bd_intf_pin -mode Slave -vlnv xilinx.com:interface:axis_rtl:1.0 LINK_DATA1_IN
create_bd_intf_pin -mode Slave -vlnv xilinx.com:interface:axis_rtl:1.0 LINK_DATA2_IN
create_bd_intf_pin -mode Master -vlnv xilinx.com:interface:aximm_rtl:1.0 M_AXI_S2MM
create_bd_intf_pin -mode Slave -vlnv xilinx.com:interface:axis_rtl:1.0 SB_STATUS_IN
create_bd_intf_pin -mode Slave -vlnv xilinx.com:interface:aximm_rtl:1.0 S_AXI_CPU_IN
create_bd_intf_pin -mode Slave -vlnv xilinx.com:interface:aximm_rtl:1.0 s_axi_CTRL
create_bd_intf_pin -mode Slave -vlnv xilinx.com:interface:aximm_rtl:1.0 s_axi_ctrl1
create_bd_pin -dir I -from 94 -to 0 Din
create_bd_pin -dir I cable_detect
create_bd_pin -dir I -type clk clk_50mhz
create_bd_pin -dir O hdmi_hb
create_bd_pin -dir O -from 0 -to 0 hpd
create_bd_pin -dir O -type intr irq
create_bd_pin -dir I -type clk link_clk
create_bd_pin -dir I -type clk m_axi_s2mm_aclk
create_bd_pin -dir O -type intr s2mm_introut
create_bd_pin -dir I -from 0 -to 0 -type rst s_axi_cpu_aresetn
create_bd_pin -dir I -from 0 -to 0 -type rst s_axis_video_aresetn
create_bd_pin -dir I -type clk video_clk

create_bd_cell -type ip -vlnv xilinx.com:ip:xlslice:1.0 frmbuf_wr_rst_gpio
set_property -dict {CONFIG.DIN_FROM 10 CONFIG.DIN_TO 10 CONFIG.DIN_WIDTH 95 CONFIG.DOUT_WIDTH 1} [get_bd_cells frmbuf_wr_rst_gpio]
create_bd_cell -type ip -vlnv xilinx.com:user:hdmi_hb:1.0 hdmi_hb_rx
create_bd_cell -type ip -vlnv xilinx.com:ip:xlslice:1.0 vpss_scaler_rst_gpio
set_property -dict {CONFIG.DIN_FROM 9 CONFIG.DIN_TO 9 CONFIG.DIN_WIDTH 95 CONFIG.DOUT_WIDTH 1} [get_bd_cells vpss_scaler_rst_gpio]
create_bd_cell -type ip -vlnv xilinx.com:ip:axi_data_fifo:2.1 axi_data_fifo_0
set_property -dict {CONFIG.WRITE_FIFO_DELAY 1 CONFIG.WRITE_FIFO_DEPTH 512} [get_bd_cells axi_data_fifo_0]
create_bd_cell -type ip -vlnv xilinx.com:ip:v_frmbuf_wr:2.1 v_frmbuf_wr_0
set_property -dict [list \
  CONFIG.AXIMM_DATA_WIDTH 128 \
  CONFIG.C_M_AXI_MM_VIDEO_DATA_WIDTH 128 \
  CONFIG.HAS_RGB8 0 \
  CONFIG.HAS_RGBX8 0 \
  CONFIG.HAS_UYVY8 1 \
  CONFIG.HAS_Y8 1 \
  CONFIG.HAS_YUV8 0 \
  CONFIG.HAS_YUVX8 0 \
  CONFIG.HAS_YUYV8 1 \
  CONFIG.HAS_Y_UV8 0 \
  CONFIG.HAS_Y_UV8_420 0 \
  CONFIG.MAX_NR_PLANES 1 \
  CONFIG.SAMPLES_PER_CLOCK 2 \
] [get_bd_cells v_frmbuf_wr_0]
create_bd_cell -type ip -vlnv xilinx.com:ip:v_hdmi_rx_ss:3.1 v_hdmi_rx_ss_0
set_property -dict [list \
  CONFIG.C_CD_INVERT true \
  CONFIG.C_INCLUDE_YUV420_SUP true \
  CONFIG.C_INPUT_PIXELS_PER_CLOCK 2 \
] [get_bd_cells v_hdmi_rx_ss_0]
create_bd_cell -type ip -vlnv xilinx.com:ip:v_proc_ss:2.0 v_proc_ss_scaler
set_property -dict [list \
  CONFIG.C_COLORSPACE_SUPPORT 0 \
  CONFIG.C_ENABLE_CSC true \
  CONFIG.C_H_SCALER_TAPS 8 \
  CONFIG.C_MAX_DATA_WIDTH 8 \
  CONFIG.C_SAMPLES_PER_CLK 2 \
  CONFIG.C_TOPOLOGY 0 \
  CONFIG.C_V_SCALER_TAPS 8 \
] [get_bd_cells v_proc_ss_scaler]

# ---- hierarchy /hdmi_output ----
current_bd_instance /hdmi_output
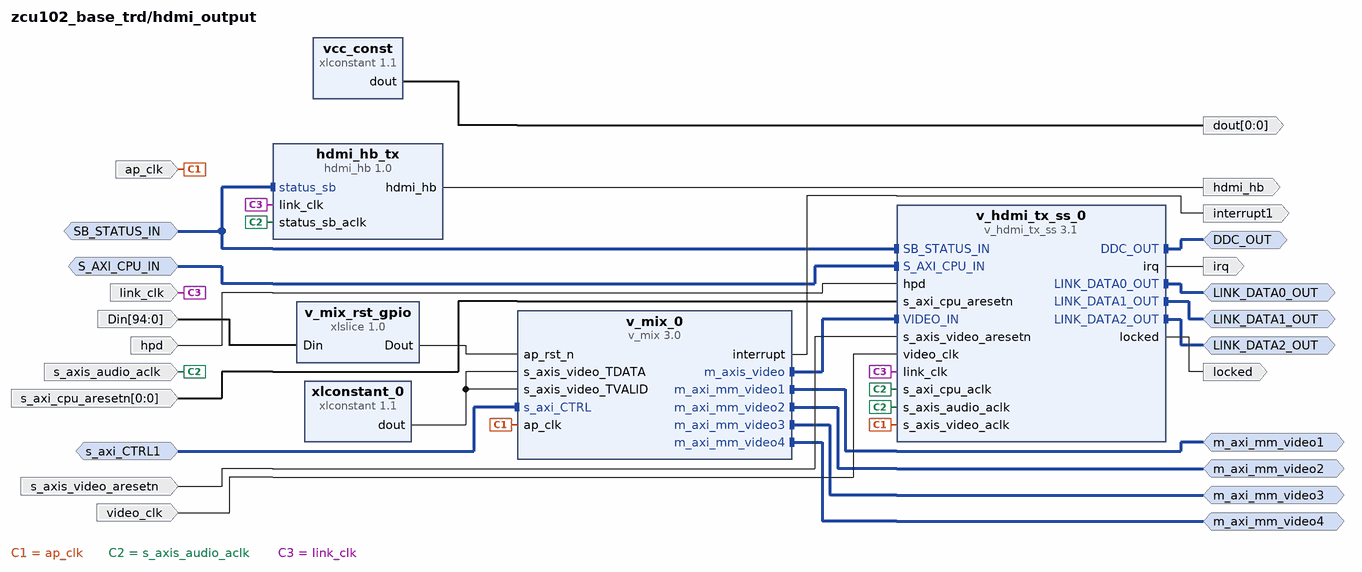
[diagram p3: block diagram inside /hdmi_output]
create_bd_intf_pin -mode Master -vlnv xilinx.com:interface:iic_rtl:1.0 DDC_OUT
create_bd_intf_pin -mode Master -vlnv xilinx.com:interface:axis_rtl:1.0 LINK_DATA0_OUT
create_bd_intf_pin -mode Master -vlnv xilinx.com:interface:axis_rtl:1.0 LINK_DATA1_OUT
create_bd_intf_pin -mode Master -vlnv xilinx.com:interface:axis_rtl:1.0 LINK_DATA2_OUT
create_bd_intf_pin -mode Slave -vlnv xilinx.com:interface:axis_rtl:1.0 SB_STATUS_IN
create_bd_intf_pin -mode Slave -vlnv xilinx.com:interface:aximm_rtl:1.0 S_AXI_CPU_IN
create_bd_intf_pin -mode Master -vlnv xilinx.com:interface:aximm_rtl:1.0 m_axi_mm_video1
create_bd_intf_pin -mode Master -vlnv xilinx.com:interface:aximm_rtl:1.0 m_axi_mm_video2
create_bd_intf_pin -mode Master -vlnv xilinx.com:interface:aximm_rtl:1.0 m_axi_mm_video3
create_bd_intf_pin -mode Master -vlnv xilinx.com:interface:aximm_rtl:1.0 m_axi_mm_video4
create_bd_intf_pin -mode Slave -vlnv xilinx.com:interface:aximm_rtl:1.0 s_axi_CTRL1
create_bd_pin -dir I -from 94 -to 0 Din
create_bd_pin -dir I -type clk ap_clk
create_bd_pin -dir O -from 0 -to 0 dout
create_bd_pin -dir O hdmi_hb
create_bd_pin -dir I hpd
create_bd_pin -dir O -type intr interrupt1
create_bd_pin -dir O -type intr irq
create_bd_pin -dir I -type clk link_clk
create_bd_pin -dir O locked
create_bd_pin -dir I -from 0 -to 0 -type rst s_axi_cpu_aresetn
create_bd_pin -dir I -type clk s_axis_audio_aclk
create_bd_pin -dir I -type rst s_axis_video_aresetn
create_bd_pin -dir I -type clk video_clk

create_bd_cell -type ip -vlnv xilinx.com:user:hdmi_hb:1.0 hdmi_hb_tx
create_bd_cell -type ip -vlnv xilinx.com:ip:xlslice:1.0 v_mix_rst_gpio
set_property -dict {CONFIG.DIN_FROM 5 CONFIG.DIN_TO 5 CONFIG.DIN_WIDTH 95 CONFIG.DOUT_WIDTH 1} [get_bd_cells v_mix_rst_gpio]
create_bd_cell -type ip -vlnv xilinx.com:ip:v_hdmi_tx_ss:3.1 v_hdmi_tx_ss_0
set_property -dict [list \
  CONFIG.C_INPUT_PIXELS_PER_CLOCK 2 \
  CONFIG.C_MAX_BITS_PER_COMPONENT 8 \
  CONFIG.C_VID_INTERFACE 0 \
] [get_bd_cells v_hdmi_tx_ss_0]
create_bd_cell -type ip -vlnv xilinx.com:ip:v_mix:3.0 v_mix_0
set_property -dict [list \
  CONFIG.AXIMM_NUM_OUTSTANDING 16 \
  CONFIG.LAYER1_ALPHA true \
  CONFIG.LAYER1_VIDEO_FORMAT 12 \
  CONFIG.LAYER2_ALPHA true \
  CONFIG.LAYER2_VIDEO_FORMAT 12 \
  CONFIG.LAYER3_ALPHA true \
  CONFIG.LAYER3_VIDEO_FORMAT 28 \
  CONFIG.LAYER4_VIDEO_FORMAT 26 \
  CONFIG.LOGO_LAYER false \
  CONFIG.NR_LAYERS 5 \
  CONFIG.SAMPLES_PER_CLOCK 2 \
  CONFIG.VIDEO_FORMAT 0 \
] [get_bd_cells v_mix_0]
create_bd_cell -type ip -vlnv xilinx.com:ip:xlconstant:1.1 vcc_const
create_bd_cell -type ip -vlnv xilinx.com:ip:xlconstant:1.1 xlconstant_0
set_property -dict {CONFIG.CONST_VAL 0 CONFIG.CONST_WIDTH 48} [get_bd_cells xlconstant_0]

# ---- hierarchy /mipi_csi2_rx ----
current_bd_instance /mipi_csi2_rx
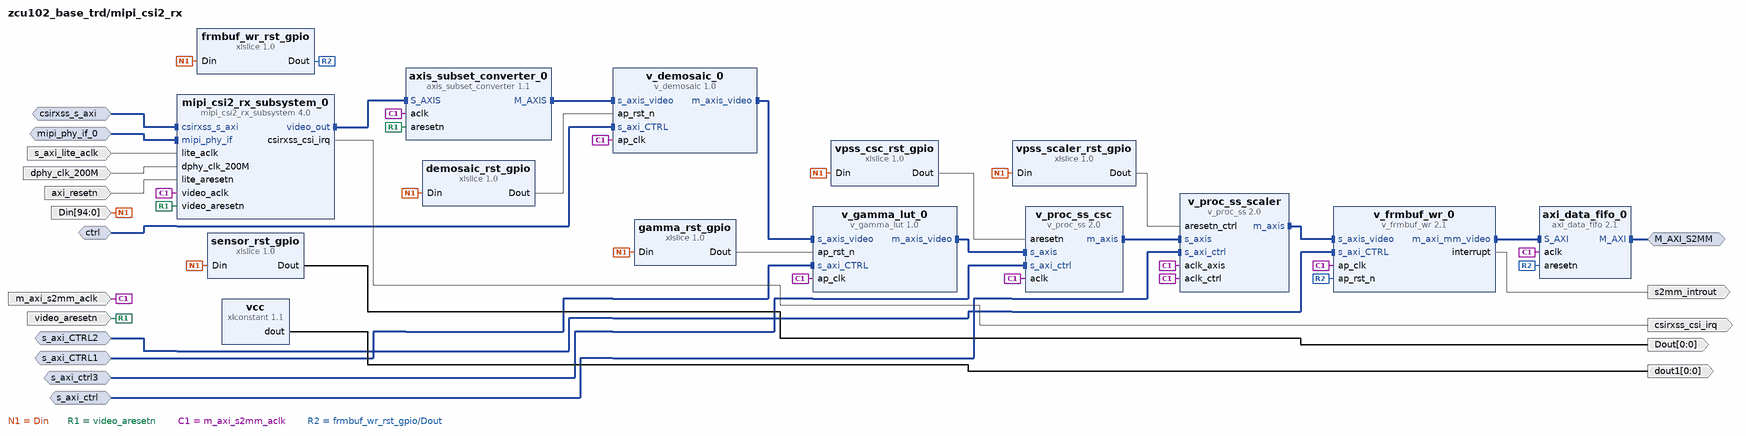
[diagram p4: block diagram inside /mipi_csi2_rx]
create_bd_intf_pin -mode Master -vlnv xilinx.com:interface:aximm_rtl:1.0 M_AXI_S2MM
create_bd_intf_pin -mode Slave -vlnv xilinx.com:interface:aximm_rtl:1.0 csirxss_s_axi
create_bd_intf_pin -mode Slave -vlnv xilinx.com:interface:aximm_rtl:1.0 ctrl
create_bd_intf_pin -mode Slave -vlnv xilinx.com:interface:mipi_phy_rtl:1.0 mipi_phy_if_0
create_bd_intf_pin -mode Slave -vlnv xilinx.com:interface:aximm_rtl:1.0 s_axi_CTRL1
create_bd_intf_pin -mode Slave -vlnv xilinx.com:interface:aximm_rtl:1.0 s_axi_CTRL2
create_bd_intf_pin -mode Slave -vlnv xilinx.com:interface:aximm_rtl:1.0 s_axi_ctrl
create_bd_intf_pin -mode Slave -vlnv xilinx.com:interface:aximm_rtl:1.0 s_axi_ctrl3
create_bd_pin -dir I -from 94 -to 0 Din
create_bd_pin -dir O -from 0 -to 0 Dout
create_bd_pin -dir I -type rst axi_resetn
create_bd_pin -dir O -type intr csirxss_csi_irq
create_bd_pin -dir O -from 0 -to 0 dout1
create_bd_pin -dir I -type clk dphy_clk_200M
create_bd_pin -dir I -type clk m_axi_s2mm_aclk
create_bd_pin -dir O -type intr s2mm_introut
create_bd_pin -dir I -type clk s_axi_lite_aclk
create_bd_pin -dir I -type rst video_aresetn

create_bd_cell -type ip -vlnv xilinx.com:ip:xlslice:1.0 demosaic_rst_gpio
set_property -dict {CONFIG.DIN_FROM 7 CONFIG.DIN_TO 7 CONFIG.DIN_WIDTH 95 CONFIG.DOUT_WIDTH 1} [get_bd_cells demosaic_rst_gpio]
create_bd_cell -type ip -vlnv xilinx.com:ip:xlslice:1.0 frmbuf_wr_rst_gpio
set_property -dict {CONFIG.DIN_FROM 2 CONFIG.DIN_TO 2 CONFIG.DIN_WIDTH 95 CONFIG.DOUT_WIDTH 1} [get_bd_cells frmbuf_wr_rst_gpio]
create_bd_cell -type ip -vlnv xilinx.com:ip:xlslice:1.0 gamma_rst_gpio
set_property -dict {CONFIG.DIN_FROM 8 CONFIG.DIN_TO 8 CONFIG.DIN_WIDTH 95 CONFIG.DOUT_WIDTH 1} [get_bd_cells gamma_rst_gpio]
create_bd_cell -type ip -vlnv xilinx.com:ip:xlslice:1.0 sensor_rst_gpio
set_property -dict {CONFIG.DIN_FROM 12 CONFIG.DIN_TO 12 CONFIG.DIN_WIDTH 95 CONFIG.DOUT_WIDTH 1} [get_bd_cells sensor_rst_gpio]
create_bd_cell -type ip -vlnv xilinx.com:ip:xlslice:1.0 vpss_csc_rst_gpio
set_property -dict {CONFIG.DIN_FROM 6 CONFIG.DIN_TO 6 CONFIG.DIN_WIDTH 95 CONFIG.DOUT_WIDTH 1} [get_bd_cells vpss_csc_rst_gpio]
create_bd_cell -type ip -vlnv xilinx.com:ip:xlslice:1.0 vpss_scaler_rst_gpio
set_property -dict {CONFIG.DIN_FROM 4 CONFIG.DIN_TO 4 CONFIG.DIN_WIDTH 95 CONFIG.DOUT_WIDTH 1} [get_bd_cells vpss_scaler_rst_gpio]
create_bd_cell -type ip -vlnv xilinx.com:ip:axi_data_fifo:2.1 axi_data_fifo_0
set_property -dict {CONFIG.WRITE_FIFO_DELAY 1 CONFIG.WRITE_FIFO_DEPTH 512} [get_bd_cells axi_data_fifo_0]
create_bd_cell -type ip -vlnv xilinx.com:ip:axis_subset_converter:1.1 axis_subset_converter_0
set_property -dict [list \
  CONFIG.M_TDATA_NUM_BYTES 2 \
  CONFIG.S_TDATA_NUM_BYTES 3 \
  CONFIG.TDATA_REMAP {tdata[19:12],tdata[9:2]} \
  CONFIG.TDEST_REMAP {tdest[9:0]} \
  CONFIG.TLAST_REMAP {tlast[0]} \
  CONFIG.TUSER_REMAP {tuser[0:0]} \
] [get_bd_cells axis_subset_converter_0]
create_bd_cell -type ip -vlnv xilinx.com:ip:mipi_csi2_rx_subsystem:4.0 mipi_csi2_rx_subsystem_0
set_property -dict [list \
  CONFIG.CLK_LANE_IO_LOC Y4 \
  CONFIG.CMN_INC_IIC false \
  CONFIG.CMN_NUM_LANES 4 \
  CONFIG.CMN_NUM_PIXELS 2 \
  CONFIG.CMN_PROJ_FAMILY 1 \
  CONFIG.CMN_PXL_FORMAT RAW10 \
  CONFIG.CMN_VC All \
  CONFIG.CSI_BUF_DEPTH 4096 \
  CONFIG.C_CLK_LANE_IO_POSITION 26 \
  CONFIG.C_CSI_EN_ACTIVELANES true \
  CONFIG.C_CSI_FILTER_USERDATATYPE true \
  CONFIG.C_DATA_LANE0_IO_POSITION 30 \
  CONFIG.C_DATA_LANE1_IO_POSITION 32 \
  CONFIG.C_DATA_LANE2_IO_POSITION 34 \
  CONFIG.C_DATA_LANE3_IO_POSITION 36 \
  CONFIG.C_DPHY_LANES 4 \
  CONFIG.C_EN_BG0_PIN0 false \
  CONFIG.C_EN_BG1_PIN0 false \
  CONFIG.C_EN_BG3_PIN0 false \
  CONFIG.C_HS_LINE_RATE 1440 \
  CONFIG.C_HS_SETTLE_NS 141 \
  CONFIG.DATA_LANE0_IO_LOC W5 \
  CONFIG.DATA_LANE1_BYTE All_Byte \
  CONFIG.DATA_LANE1_IO_LOC AB4 \
  CONFIG.DATA_LANE2_BYTE All_Byte \
  CONFIG.DATA_LANE2_IO_LOC V4 \
  CONFIG.DATA_LANE3_BYTE All_Byte \
  CONFIG.DATA_LANE3_IO_LOC U5 \
  CONFIG.DPY_EN_REG_IF false \
  CONFIG.DPY_LINE_RATE 1440 \
  CONFIG.HP_IO_BANK_SELECTION 66 \
  CONFIG.SupportLevel 1 \
] [get_bd_cells mipi_csi2_rx_subsystem_0]
create_bd_cell -type ip -vlnv xilinx.com:ip:v_demosaic:1.0 v_demosaic_0
set_property -dict {CONFIG.ENABLE_ZIPPER_REMOVAL false CONFIG.SAMPLES_PER_CLOCK 2} [get_bd_cells v_demosaic_0]
create_bd_cell -type ip -vlnv xilinx.com:ip:v_frmbuf_wr:2.1 v_frmbuf_wr_0
set_property -dict [list \
  CONFIG.AXIMM_DATA_WIDTH 128 \
  CONFIG.C_M_AXI_MM_VIDEO_DATA_WIDTH 128 \
  CONFIG.HAS_RGB8 0 \
  CONFIG.HAS_RGBX8 0 \
  CONFIG.HAS_UYVY8 1 \
  CONFIG.HAS_Y8 1 \
  CONFIG.HAS_YUV8 0 \
  CONFIG.HAS_YUVX8 0 \
  CONFIG.HAS_YUYV8 1 \
  CONFIG.HAS_Y_UV8 0 \
  CONFIG.HAS_Y_UV8_420 0 \
  CONFIG.MAX_NR_PLANES 1 \
  CONFIG.SAMPLES_PER_CLOCK 2 \
] [get_bd_cells v_frmbuf_wr_0]
create_bd_cell -type ip -vlnv xilinx.com:ip:v_gamma_lut:1.0 v_gamma_lut_0
set_property -dict {CONFIG.SAMPLES_PER_CLOCK 2} [get_bd_cells v_gamma_lut_0]
create_bd_cell -type ip -vlnv xilinx.com:ip:v_proc_ss:2.0 v_proc_ss_csc
set_property -dict [list \
  CONFIG.C_COLORSPACE_SUPPORT 2 \
  CONFIG.C_CSC_ENABLE_WINDOW false \
  CONFIG.C_MAX_DATA_WIDTH 8 \
  CONFIG.C_SAMPLES_PER_CLK 2 \
  CONFIG.C_TOPOLOGY 3 \
] [get_bd_cells v_proc_ss_csc]
create_bd_cell -type ip -vlnv xilinx.com:ip:v_proc_ss:2.0 v_proc_ss_scaler
set_property -dict [list \
  CONFIG.C_COLORSPACE_SUPPORT 1 \
  CONFIG.C_ENABLE_CSC true \
  CONFIG.C_H_SCALER_TAPS 8 \
  CONFIG.C_MAX_DATA_WIDTH 8 \
  CONFIG.C_SAMPLES_PER_CLK 2 \
  CONFIG.C_TOPOLOGY 0 \
  CONFIG.C_V_SCALER_TAPS 8 \
] [get_bd_cells v_proc_ss_scaler]
create_bd_cell -type ip -vlnv xilinx.com:ip:xlconstant:1.1 vcc

# ---- hierarchy /tpg_input ----
current_bd_instance /tpg_input
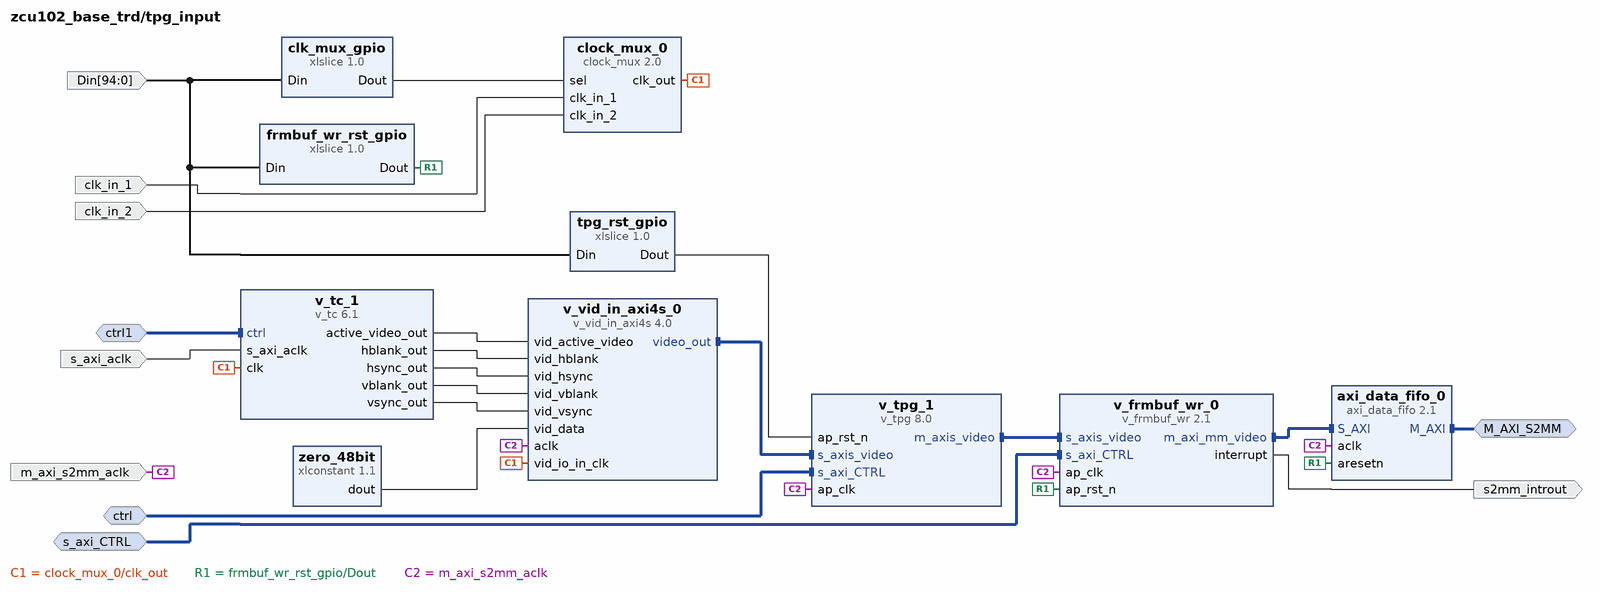
[diagram p5: block diagram inside /tpg_input]
create_bd_intf_pin -mode Master -vlnv xilinx.com:interface:aximm_rtl:1.0 M_AXI_S2MM
create_bd_intf_pin -mode Slave -vlnv xilinx.com:interface:aximm_rtl:1.0 ctrl
create_bd_intf_pin -mode Slave -vlnv xilinx.com:interface:aximm_rtl:1.0 ctrl1
create_bd_intf_pin -mode Slave -vlnv xilinx.com:interface:aximm_rtl:1.0 s_axi_CTRL
create_bd_pin -dir I -from 94 -to 0 Din
create_bd_pin -dir I clk_in_1
create_bd_pin -dir I clk_in_2
create_bd_pin -dir I -type clk m_axi_s2mm_aclk
create_bd_pin -dir O -type intr s2mm_introut
create_bd_pin -dir I -type clk s_axi_aclk

create_bd_cell -type ip -vlnv xilinx.com:ip:xlslice:1.0 clk_mux_gpio
set_property -dict {CONFIG.DIN_FROM 0 CONFIG.DIN_TO 0 CONFIG.DIN_WIDTH 95 CONFIG.DOUT_WIDTH 1} [get_bd_cells clk_mux_gpio]
create_bd_cell -type ip -vlnv xilinx.com:user:clock_mux:2.0 clock_mux_0
create_bd_cell -type ip -vlnv xilinx.com:ip:xlslice:1.0 frmbuf_wr_rst_gpio
set_property -dict {CONFIG.DIN_FROM 3 CONFIG.DIN_TO 3 CONFIG.DIN_WIDTH 95 CONFIG.DOUT_WIDTH 1} [get_bd_cells frmbuf_wr_rst_gpio]
create_bd_cell -type ip -vlnv xilinx.com:ip:xlslice:1.0 tpg_rst_gpio
set_property -dict {CONFIG.DIN_FROM 1 CONFIG.DIN_TO 1 CONFIG.DIN_WIDTH 95 CONFIG.DOUT_WIDTH 1} [get_bd_cells tpg_rst_gpio]
create_bd_cell -type ip -vlnv xilinx.com:ip:axi_data_fifo:2.1 axi_data_fifo_0
set_property -dict {CONFIG.WRITE_FIFO_DELAY 1 CONFIG.WRITE_FIFO_DEPTH 512} [get_bd_cells axi_data_fifo_0]
create_bd_cell -type ip -vlnv xilinx.com:ip:v_frmbuf_wr:2.1 v_frmbuf_wr_0
set_property -dict [list \
  CONFIG.AXIMM_DATA_WIDTH 128 \
  CONFIG.C_M_AXI_MM_VIDEO_DATA_WIDTH 128 \
  CONFIG.HAS_RGB8 0 \
  CONFIG.HAS_RGBX8 0 \
  CONFIG.HAS_UYVY8 1 \
  CONFIG.HAS_Y8 1 \
  CONFIG.HAS_YUV8 0 \
  CONFIG.HAS_YUVX8 0 \
  CONFIG.HAS_YUYV8 1 \
  CONFIG.HAS_Y_UV8 0 \
  CONFIG.HAS_Y_UV8_420 0 \
  CONFIG.MAX_NR_PLANES 1 \
  CONFIG.SAMPLES_PER_CLOCK 2 \
] [get_bd_cells v_frmbuf_wr_0]
create_bd_cell -type ip -vlnv xilinx.com:ip:v_tc:6.1 v_tc_1
set_property -dict [list \
  CONFIG.VIDEO_MODE 1080p \
  CONFIG.enable_detection false \
  CONFIG.max_clocks_per_line 8192 \
  CONFIG.max_lines_per_frame 8192 \
  CONFIG.vertical_blank_generation true \
] [get_bd_cells v_tc_1]
create_bd_cell -type ip -vlnv xilinx.com:ip:v_tpg:8.0 v_tpg_1
set_property -dict [list \
  CONFIG.HAS_AXI4S_SLAVE 1 \
  CONFIG.MAX_COLS 3840 \
  CONFIG.MAX_ROWS 2160 \
  CONFIG.SAMPLES_PER_CLOCK 2 \
] [get_bd_cells v_tpg_1]
create_bd_cell -type ip -vlnv xilinx.com:ip:v_vid_in_axi4s:4.0 v_vid_in_axi4s_0
set_property -dict [list \
  CONFIG.C_ADDR_WIDTH 5 \
  CONFIG.C_HAS_ASYNC_CLK 1 \
  CONFIG.C_M_AXIS_VIDEO_FORMAT 2 \
  CONFIG.C_PIXELS_PER_CLOCK 2 \
] [get_bd_cells v_vid_in_axi4s_0]
create_bd_cell -type ip -vlnv xilinx.com:ip:xlconstant:1.1 zero_48bit
set_property -dict {CONFIG.CONST_VAL 0 CONFIG.CONST_WIDTH 48} [get_bd_cells zero_48bit]

# ---- connections ----

current_bd_instance /dru_clk
connect_bd_intf_net [get_bd_intf_pins CLK_IN_D] [get_bd_intf_pins dru_ibufds_gt/CLK_IN_D]
connect_bd_net [get_bd_pins const_vcc/dout] [get_bd_pins dru_ibufds_gt_odiv2/BUFG_GT_CE]
connect_bd_net -net util_ds_buf_0_IBUF_DS_ODIV2 [get_bd_pins dru_ibufds_gt/IBUF_DS_ODIV2] [get_bd_pins dru_ibufds_gt_odiv2/BUFG_GT_I]
connect_bd_net -net util_ds_buf_0_IBUF_OUT [get_bd_pins dru_ibufds_gt/IBUF_OUT] [get_bd_pins IBUF_OUT]
connect_bd_net -net util_ds_buf_1_BUFG_GT_O [get_bd_pins dru_ibufds_gt_odiv2/BUFG_GT_O] [get_bd_pins BUFG_GT_O]

current_bd_instance /hdmi_input
connect_bd_intf_net [get_bd_intf_pins LINK_DATA1_IN] [get_bd_intf_pins v_hdmi_rx_ss_0/LINK_DATA1_IN]
connect_bd_intf_net [get_bd_intf_pins LINK_DATA2_IN] [get_bd_intf_pins v_hdmi_rx_ss_0/LINK_DATA2_IN]
connect_bd_intf_net [get_bd_intf_pins SB_STATUS_IN] [get_bd_intf_pins v_hdmi_rx_ss_0/SB_STATUS_IN]
connect_bd_intf_net [get_bd_intf_pins SB_STATUS_IN] [get_bd_intf_pins hdmi_hb_rx/status_sb]
connect_bd_intf_net [get_bd_intf_pins v_hdmi_rx_ss_0/VIDEO_OUT] [get_bd_intf_pins v_proc_ss_scaler/s_axis]
connect_bd_intf_net [get_bd_intf_pins LINK_DATA0_IN] [get_bd_intf_pins v_hdmi_rx_ss_0/LINK_DATA0_IN]
connect_bd_intf_net [get_bd_intf_pins DDC_OUT] [get_bd_intf_pins v_hdmi_rx_ss_0/DDC_OUT]
connect_bd_intf_net [get_bd_intf_pins M_AXI_S2MM] [get_bd_intf_pins axi_data_fifo_0/M_AXI]
connect_bd_intf_net [get_bd_intf_pins axi_data_fifo_0/S_AXI] [get_bd_intf_pins v_frmbuf_wr_0/m_axi_mm_video]
connect_bd_intf_net [get_bd_intf_pins v_frmbuf_wr_0/s_axis_video] [get_bd_intf_pins v_proc_ss_scaler/m_axis]
connect_bd_intf_net [get_bd_intf_pins s_axi_CTRL] [get_bd_intf_pins v_frmbuf_wr_0/s_axi_CTRL]
connect_bd_intf_net [get_bd_intf_pins S_AXI_CPU_IN] [get_bd_intf_pins v_hdmi_rx_ss_0/S_AXI_CPU_IN]
connect_bd_intf_net [get_bd_intf_pins s_axi_ctrl1] [get_bd_intf_pins v_proc_ss_scaler/s_axi_ctrl]
connect_bd_net [get_bd_pins Din] [get_bd_pins frmbuf_wr_rst_gpio/Din] [get_bd_pins vpss_scaler_rst_gpio/Din]
connect_bd_net [get_bd_pins cable_detect] [get_bd_pins v_hdmi_rx_ss_0/cable_detect]
connect_bd_net -net clk_75mhz [get_bd_pins clk_50mhz] \
  [get_bd_pins hdmi_hb_rx/status_sb_aclk] [get_bd_pins v_hdmi_rx_ss_0/s_axi_cpu_aclk] \
  [get_bd_pins v_hdmi_rx_ss_0/s_axis_audio_aclk]
connect_bd_net [get_bd_pins frmbuf_wr_rst_gpio/Dout] [get_bd_pins axi_data_fifo_0/aresetn] [get_bd_pins v_frmbuf_wr_0/ap_rst_n]
connect_bd_net [get_bd_pins hdmi_hb_rx/hdmi_hb] [get_bd_pins hdmi_hb]
connect_bd_net [get_bd_pins link_clk] [get_bd_pins hdmi_hb_rx/link_clk] [get_bd_pins v_hdmi_rx_ss_0/link_clk]
connect_bd_net [get_bd_pins m_axi_s2mm_aclk] \
  [get_bd_pins axi_data_fifo_0/aclk] [get_bd_pins v_frmbuf_wr_0/ap_clk] [get_bd_pins v_hdmi_rx_ss_0/s_axis_video_aclk] \
  [get_bd_pins v_proc_ss_scaler/aclk_axis] [get_bd_pins v_proc_ss_scaler/aclk_ctrl]
connect_bd_net [get_bd_pins s_axi_cpu_aresetn] [get_bd_pins v_hdmi_rx_ss_0/s_axi_cpu_aresetn]
connect_bd_net [get_bd_pins s_axis_video_aresetn] [get_bd_pins v_hdmi_rx_ss_0/s_axis_video_aresetn]
connect_bd_net [get_bd_pins v_frmbuf_wr_0/interrupt] [get_bd_pins s2mm_introut]
connect_bd_net [get_bd_pins v_hdmi_rx_ss_0/hpd] [get_bd_pins hpd]
connect_bd_net [get_bd_pins v_hdmi_rx_ss_0/irq] [get_bd_pins irq]
connect_bd_net [get_bd_pins video_clk] [get_bd_pins v_hdmi_rx_ss_0/video_clk]
connect_bd_net [get_bd_pins vpss_scaler_rst_gpio/Dout] [get_bd_pins v_proc_ss_scaler/aresetn_ctrl]

current_bd_instance /hdmi_output
connect_bd_intf_net [get_bd_intf_pins m_axi_mm_video2] [get_bd_intf_pins v_mix_0/m_axi_mm_video2]
connect_bd_intf_net [get_bd_intf_pins s_axi_CTRL1] [get_bd_intf_pins v_mix_0/s_axi_CTRL]
connect_bd_intf_net [get_bd_intf_pins v_hdmi_tx_ss_0/VIDEO_IN] [get_bd_intf_pins v_mix_0/m_axis_video]
connect_bd_intf_net [get_bd_intf_pins SB_STATUS_IN] [get_bd_intf_pins v_hdmi_tx_ss_0/SB_STATUS_IN]
connect_bd_intf_net [get_bd_intf_pins SB_STATUS_IN] [get_bd_intf_pins hdmi_hb_tx/status_sb]
connect_bd_intf_net [get_bd_intf_pins LINK_DATA2_OUT] [get_bd_intf_pins v_hdmi_tx_ss_0/LINK_DATA2_OUT]
connect_bd_intf_net [get_bd_intf_pins DDC_OUT] [get_bd_intf_pins v_hdmi_tx_ss_0/DDC_OUT]
connect_bd_intf_net [get_bd_intf_pins LINK_DATA0_OUT] [get_bd_intf_pins v_hdmi_tx_ss_0/LINK_DATA0_OUT]
connect_bd_intf_net [get_bd_intf_pins LINK_DATA1_OUT] [get_bd_intf_pins v_hdmi_tx_ss_0/LINK_DATA1_OUT]
connect_bd_intf_net [get_bd_intf_pins S_AXI_CPU_IN] [get_bd_intf_pins v_hdmi_tx_ss_0/S_AXI_CPU_IN]
connect_bd_intf_net [get_bd_intf_pins m_axi_mm_video1] [get_bd_intf_pins v_mix_0/m_axi_mm_video1]
connect_bd_intf_net [get_bd_intf_pins m_axi_mm_video3] [get_bd_intf_pins v_mix_0/m_axi_mm_video3]
connect_bd_intf_net [get_bd_intf_pins m_axi_mm_video4] [get_bd_intf_pins v_mix_0/m_axi_mm_video4]
connect_bd_net [get_bd_pins Din] [get_bd_pins v_mix_rst_gpio/Din]
connect_bd_net [get_bd_pins ap_clk] [get_bd_pins v_hdmi_tx_ss_0/s_axis_video_aclk] [get_bd_pins v_mix_0/ap_clk]
connect_bd_net -net clk_50mhz [get_bd_pins s_axis_audio_aclk] \
  [get_bd_pins hdmi_hb_tx/status_sb_aclk] [get_bd_pins v_hdmi_tx_ss_0/s_axi_cpu_aclk] \
  [get_bd_pins v_hdmi_tx_ss_0/s_axis_audio_aclk]
connect_bd_net [get_bd_pins hdmi_hb_tx/hdmi_hb] [get_bd_pins hdmi_hb]
connect_bd_net [get_bd_pins hpd] [get_bd_pins v_hdmi_tx_ss_0/hpd]
connect_bd_net -net proc_sys_reset_clk50_peripheral_aresetn [get_bd_pins s_axi_cpu_aresetn] [get_bd_pins v_hdmi_tx_ss_0/s_axi_cpu_aresetn]
connect_bd_net [get_bd_pins s_axis_video_aresetn] [get_bd_pins v_hdmi_tx_ss_0/s_axis_video_aresetn]
connect_bd_net [get_bd_pins v_hdmi_tx_ss_0/irq] [get_bd_pins irq]
connect_bd_net [get_bd_pins v_hdmi_tx_ss_0/locked] [get_bd_pins locked]
connect_bd_net [get_bd_pins v_mix_0/interrupt] [get_bd_pins interrupt1]
connect_bd_net [get_bd_pins v_mix_rst_gpio/Dout] [get_bd_pins v_mix_0/ap_rst_n]
connect_bd_net [get_bd_pins vcc_const/dout] [get_bd_pins dout]
connect_bd_net -net vid_phy_controller_0_tx_video_clk [get_bd_pins video_clk] [get_bd_pins v_hdmi_tx_ss_0/video_clk]
connect_bd_net -net vid_phy_controller_0_txoutclk [get_bd_pins link_clk] [get_bd_pins hdmi_hb_tx/link_clk] [get_bd_pins v_hdmi_tx_ss_0/link_clk]
connect_bd_net [get_bd_pins xlconstant_0/dout] [get_bd_pins v_mix_0/s_axis_video_TVALID] [get_bd_pins v_mix_0/s_axis_video_TDATA]
